# Altium schematic sheet pmic_tps65263_buck.SchDoc
size A
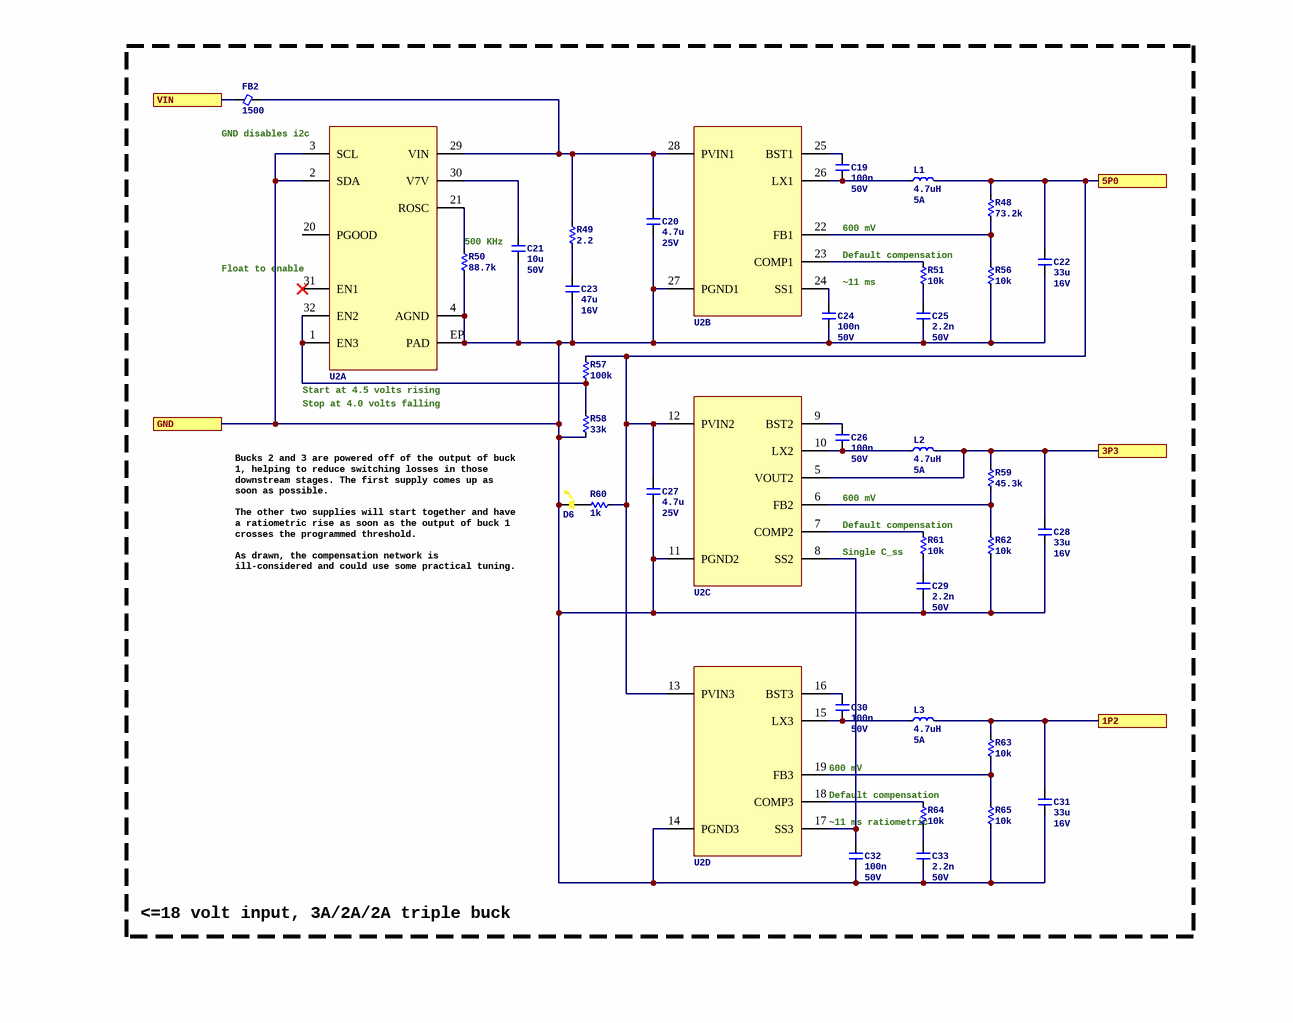
[diagram p0: pmic_tps65263_buck.SchDoc]

## Parts
C19  Capacitance: 100n  Voltage Rating: 50V  [C0402]  (hidden comment: CL05B104KB54PNC)
C20  Capacitance: 4.7u  Voltage Rating: 25V  [C0805]  (hidden comment: CL21B475KAFNNNE)
C21  Capacitance: 10u  Voltage Rating: 50V  [C1206]  (hidden comment: CL31B106KBHNNNE)
C22  Capacitance: 33u  Voltage Rating: 16V  [C1812]  (hidden comment: C4532X7R1C336MT000N)
C23  Capacitance: 47u  Voltage Rating: 16V  [C2220]  (hidden comment: CGA9N3X7R1C476MT0Y0N)
C24  Capacitance: 100n  Voltage Rating: 50V  [C0402]  (hidden comment: CL05B104KB54PNC)
C25  Capacitance: 2.2n  Voltage Rating: 50V  [C0402]  (hidden comment: GRM1555C1H222GA01D)
C26  Capacitance: 100n  Voltage Rating: 50V  [C0402]  (hidden comment: CL05B104KB54PNC)
C27  Capacitance: 4.7u  Voltage Rating: 25V  [C0805]  (hidden comment: CL21B475KAFNNNE)
C28  Capacitance: 33u  Voltage Rating: 16V  [C1812]  (hidden comment: C4532X7R1C336MT000N)
C29  Capacitance: 2.2n  Voltage Rating: 50V  [C0402]  (hidden comment: GRM1555C1H222GA01D)
C30  Capacitance: 100n  Voltage Rating: 50V  [C0402]  (hidden comment: CL05B104KB54PNC)
C31  Capacitance: 33u  Voltage Rating: 16V  [C1812]  (hidden comment: C4532X7R1C336MT000N)
C32  Capacitance: 100n  Voltage Rating: 50V  [C0402]  (hidden comment: CL05B104KB54PNC)
C33  Capacitance: 2.2n  Voltage Rating: 50V  [C0402]  (hidden comment: GRM1555C1H222GA01D)
D6  LTST-C190YKT  [LED_0603P_YELLOW]  (value not drawn)
FB2  Current Rating (mA): 1500  [FB0805]  (hidden comment: MPZ2012S102AT000)
L1  value 4.7uH  Current: 5A  [SMD-4.1x4.1x2.0]  (hidden comment: FTC404020S4R7MGCA)
L2  value 4.7uH  Current: 5A  [SMD-4.1x4.1x2.0]  (hidden comment: FTC404020S4R7MGCA)
L3  value 4.7uH  Current: 5A  [SMD-4.1x4.1x2.0]  (hidden comment: FTC404020S4R7MGCA)
R48  value 73.2k  [R0402]  (hidden comment: 0402WGF7322TCE)
R49  value 2.2  [R0805]  (hidden comment: HP05W3F220KT5E)
R50  value 88.7k  [R0402]  (hidden comment: 0402WGF8872TCE)
R51  value 10k  [R0402]  (hidden comment: 0402WGF1002TCE)
R56  value 10k  [R0402]  (hidden comment: 0402WGF1002TCE)
R57  value 100k  [R0402]  (hidden comment: 0402WGF1003TCE)
R58  value 33k  [R0402]  (hidden comment: 0402WGF3302TCE)
R59  value 45.3k  [R0402]  (hidden comment: FRC0402F4532TS)
R60  value 1k  [R0402]  (hidden comment: 0402WGF1001TCE)
R61  value 10k  [R0402]  (hidden comment: 0402WGF1002TCE)
R62  value 10k  [R0402]  (hidden comment: 0402WGF1002TCE)
R63  value 10k  [R0402]  (hidden comment: 0402WGF1002TCE)
R64  value 10k  [R0402]  (hidden comment: 0402WGF1002TCE)
R65  value 10k  [R0402]  (hidden comment: 0402WGF1002TCE)
U2  TPS65263QRHBRQ1  [TI_RHB]  (value not drawn)  (parts A,B,C,D of 4)

## Ports
1P2, 3P3, 5P0, GND, VIN

## Nets
1P2: C31.1 L3.2 R63.2 ; port 1P2
3P3: C28.1 L2.2 R59.2 U2.5(VOUT2) ; port 3P3
5P0: C22.1 C27.1 L1.2 R48.2 R57.2 R60.2 U2.12(PVIN2) U2.13(PVIN3) ; port 5P0
GND: C20.2 C21.2 C22.2 C23.2 C24.2 C25.2 C27.2 C28.2 C29.2 C31.2 C32.2 C33.2 D6.1 R50.1 R56.1 R58.1 R62.1 R65.1 U2.2(SDA) U2.3(SCL) U2.4(AGND) U2.11(PGND2) U2.14(PGND3) U2.27(PGND1) U2.EP(PAD) ; port GND
VIN: FB2.1 ; port VIN
NetC19_1: C19.1 U2.25(BST1)
NetC19_2: C19.2 L1.1 U2.26(LX1)
NetC20_1: C20.1 FB2.2 R49.2 U2.28(PVIN1) U2.29(VIN)
NetC21_1: C21.1 U2.30(V7V)
NetC23_1: C23.1 R49.1
NetC24_1: C24.1 U2.24(SS1)
NetC25_1: C25.1 R51.1
NetC26_1: C26.1 U2.9(BST2)
NetC26_2: C26.2 L2.1 U2.10(LX2)
NetC29_1: C29.1 R61.1
NetC30_1: C30.1 U2.16(BST3)
NetC30_2: C30.2 L3.1 U2.15(LX3)
NetC32_1: C32.1 U2.8(SS2) U2.17(SS3)
NetC33_1: C33.1 R64.1
NetD6_2: D6.2 R60.1
NetR48_1: R48.1 R56.2 U2.22(FB1)
NetR50_2: R50.2 U2.21(ROSC)
NetR51_2: R51.2 U2.23(COMP1)
NetR57_1: R57.1 R58.2 U2.1(EN3) U2.32(EN2)
NetR59_1: R59.1 R62.2 U2.6(FB2)
NetR61_2: R61.2 U2.7(COMP2)
NetR63_1: R63.1 R65.2 U2.19(FB3)
NetR64_2: R64.2 U2.18(COMP3)

Not connected (* = marked no-connect by the designer): U2 20(PGOOD) 31(EN1)*

## Notes on the sheet
- GND disables i2c
- 600 mV
- (near U2) Float to enable
- (near R50) 500 KHz
- (near R51) Default compensation
- ~11 ms
- (near U2) Start at 4.5 volts rising
- Stop at 4.0 volts falling
- Single C_ss
- (near R61) Default compensation
- Bucks 2 and 3 are powered off of the output of buck 1, helping to reduce switching losses in those downstream stages. The first supply comes up as soon as possible.
  The other two supplies will start together and have a ratiometric rise as soon as the output of buck 1 crosses the programmed threshold.
  As drawn, the compensation network is ill-considered and could use some practical tuning.
- (near U2) 600 mV
- (near R64) ~11 ms ratiometric
- (near R64) Default compensation
- <=18 volt input, 3A/2A/2A triple buck

## Library data of the parts
C19 C24 C26 C30 C32 = CL05B104KB54PNC: Manufacturer: Samsung Electro-Mechanics; Dielectric: X7R; ComponentLink1URL: https://wmsc.lcsc.com/wmsc/upload/file/pdf/v2/lcsc/2304140030_Samsung-Electro-Mechanics-CL05B104KB54PNC_C307331.pdf; ComponentLink1Description: Datasheet; Manufacturer Part Number: CL05B104KB54PNC; Package: 0402; Supplier 2: LCSC; Supplier Part Number 2: C307331
C20 C27 = CL21B475KAFNNNE: Manufacturer: Samsung Electro-Mechanics; Dielectric: X7R; ComponentLink1URL: https://wmsc.lcsc.com/wmsc/upload/file/pdf/v2/lcsc/2304140030_Samsung-Electro-Mechanics-CL21B475KAFNNNE_C98195.pdf; ComponentLink1Description: Datasheet; Manufacturer Part Number: CL21B475KAFNNNE; Package: 0805; Supplier 2: LCSC; Supplier Part Number 2: C98195
C21 = CL31B106KBHNNNE: Manufacturer: Samsung Electro-Mechanics; Dielectric: X7R; ComponentLink1URL: https://wmsc.lcsc.com/wmsc/upload/file/pdf/v2/lcsc/1810221111_Samsung-Electro-Mechanics-CL31B106KBHNNNE_C89632.pdf; ComponentLink1Description: Datasheet; Manufacturer Part Number: CL31B106KBHNNNE; Package: 1206; Supplier 2: LCSC; Supplier Part Number 2: C89632
C22 C28 C31 = C4532X7R1C336MT000N: Manufacturer: TDK; Dielectric: X7R; ComponentLink1URL: https://wmsc.lcsc.com/wmsc/upload/file/pdf/v2/lcsc/2304140030_TDK-C4532X7R1C336MT000N_C342604.pdf; ComponentLink1Description: Datasheet; Manufacturer Part Number: C4532X7R1C336MT000N; Package: 1812; Supplier 2: LCSC; Supplier Part Number 2: C342604
C23 = CGA9N3X7R1C476MT0Y0N: Manufacturer: TDK; Dielectric: X7R; ComponentLink1URL: https://wmsc.lcsc.com/wmsc/upload/file/pdf/v2/lcsc/2409301933_TDK-CGA9N3X7R1C476MT0Y0N_C342293.pdf; ComponentLink1Description: Datasheet; Manufacturer Part Number: CGA9N3X7R1C476MT0Y0N; Package: 2220; Supplier 2: LCSC; Supplier Part Number 2: C342293
C25 C29 C33 = GRM1555C1H222GA01D: Manufacturer: Murata Electronics; Dielectric: C0G; ComponentLink1URL: https://wmsc.lcsc.com/wmsc/upload/file/pdf/v2/lcsc/2206211730_Murata-Electronics-GRM1555C1H222GA01D_C2987940.pdf; ComponentLink1Description: Datasheet; Manufacturer Part Number: GRM1555C1H222GA01D; Package: 0402; Supplier 2: LCSC; Supplier Part Number 2: C2987940
D6 = LED_0603_YELLOW_LTST-C190YKT: LED YELLOW CLEAR 0603 SMD; Manufacturer: Lite-On Inc; Supplier 1: Digikey; ComponentLink1URL: https://mm.digikey.com/Volume0/opasdata/d220001/medias/docus/1176/LTST-C190YKT.pdf; ComponentLink1Description: Datasheet; Supplier Part Number 1: 160-1184-1-ND; Manufacturer Part Number: LTST-C190YKT; Supplier 2: LCSC; Supplier Part Number 2: C125097
FB2 = MPZ2012S102AT000: Manufacturer: TDK; Z @ 100 MHz: 1000; DCR (mOhms): 150; Manufacturer Part Number: MPZ2012S102AT000; Package: 0805; Supplier 2: LCSC; Supplier Part Number 2: C76817; ComponentLink1Description: Datasheet; ComponentLink1URL: https://wmsc.lcsc.com/wmsc/upload/file/pdf/v2/lcsc/2304140030_TDK-MPZ2012S102AT000_C76817.pdf
L1-L3 = IND_4.7UH_FTC404020S4R7MGCA: 5A 4.7uH 6.3A 58mΩ ±20% SMD,4.1x4.1mm Fixed Inductors RoHS; Manufacturer: cjiang; ComponentLink1URL: https://www.lcsc.com/datasheet/C39676072.pdf; ComponentLink1Description: Datasheet; Manufacturer Part Number: FTC404020S4R7MGCA; Supplier 2: LCSC; Supplier Part Number 2: C39676072
R48 = 0402WGF7322TCE: Manufacturer: UNI-ROYAL(Uniroyal Elec); Tolerance: 1%; Temperature Coefficient: Â±100ppm/â„ƒ; Power Rating (mW): 62.5; ComponentLink1Description: Datasheet; ComponentLink1URL: https://wmsc.lcsc.com/wmsc/upload/file/pdf/v2/lcsc/2206010030_UNI-ROYAL-Uniroyal-Elec-0402WGF7322TCE_C26986.pdf; Manufacturer Part Number: 0402WGF7322TCE; Package: 0402; Supplier 2: LCSC; Supplier Part Number 2: C26986
R49 = HP05W3F220KT5E: Manufacturer: UNI-ROYAL(Uniroyal Elec); Tolerance: 1%; Temperature Coefficient: Â±100ppm/â„ƒ; Power Rating (mW): 333.3; ComponentLink1Description: Datasheet; ComponentLink1URL: https://datasheet.lcsc.com/lcsc/2304140030_UNI-ROYAL-Uniroyal-Elec-HP05W3F220KT5E_C2759317.pdf; Manufacturer Part Number: HP05W3F220KT5E; Package: 0805; Supplier 2: LCSC; Supplier Part Number 2: C2759317
R50 = 0402WGF8872TCE: Manufacturer: UNI-ROYAL(Uniroyal Elec); Tolerance: 1%; Temperature Coefficient: Â±100ppm/â„ƒ; Power Rating (mW): 62.5; ComponentLink1Description: Datasheet; ComponentLink1URL: https://wmsc.lcsc.com/wmsc/upload/file/pdf/v2/lcsc/2206010045_UNI-ROYAL-Uniroyal-Elec-0402WGF8872TCE_C25922.pdf; Manufacturer Part Number: 0402WGF8872TCE; Package: 0402; Supplier 2: LCSC; Supplier Part Number 2: C25922
R51 R56 R61-R65 = 0402WGF1002TCE: Manufacturer: UNI-ROYAL(Uniroyal Elec); Tolerance: 1%; Temperature Coefficient: Â±100ppm/â„ƒ; Power Rating (mW): 62.5; ComponentLink1Description: Datasheet; ComponentLink1URL: https://wmsc.lcsc.com/wmsc/upload/file/pdf/v2/lcsc/2206010100_UNI-ROYAL-Uniroyal-Elec-0402WGF1002TCE_C25744.pdf; Manufacturer Part Number: 0402WGF1002TCE; Package: 0402; Supplier 2: LCSC; Supplier Part Number 2: C25744
R57 = 0402WGF1003TCE: Manufacturer: UNI-ROYAL(Uniroyal Elec); Tolerance: 1%; Temperature Coefficient: Â±100ppm/â„ƒ; Power Rating (mW): 62.5; ComponentLink1Description: Datasheet; ComponentLink1URL: https://wmsc.lcsc.com/wmsc/upload/file/pdf/v2/lcsc/2206010100_UNI-ROYAL-Uniroyal-Elec-0402WGF1003TCE_C25741.pdf; Manufacturer Part Number: 0402WGF1003TCE; Package: 0402; Supplier 2: LCSC; Supplier Part Number 2: C25741
R58 = 0402WGF3302TCE: Manufacturer: UNI-ROYAL(Uniroyal Elec); Tolerance: 1%; Temperature Coefficient: Â±100ppm/â„ƒ; Power Rating (mW): 62.5; ComponentLink1Description: Datasheet; ComponentLink1URL: https://wmsc.lcsc.com/wmsc/upload/file/pdf/v2/lcsc/2206010100_UNI-ROYAL-Uniroyal-Elec-0402WGF3302TCE_C25779.pdf; Manufacturer Part Number: 0402WGF3302TCE; Package: 0402; Supplier 2: LCSC; Supplier Part Number 2: C25779
R59 = FRC0402F4532TS: Manufacturer: FOJAN; Tolerance: 1%; Temperature Coefficient: Â±100ppm/â„ƒ; Power Rating (mW): 62.5; ComponentLink1Description: Datasheet; ComponentLink1URL: https://datasheet.lcsc.com/lcsc/2308241947_FOJAN-FRC0402F4532TS_C2933099.pdf; Manufacturer Part Number: FRC0402F4532TS; Package: 0402; Supplier 2: LCSC; Supplier Part Number 2: C2933099
R60 = 0402WGF1001TCE: Manufacturer: UNI-ROYAL(Uniroyal Elec); Tolerance: 1%; Temperature Coefficient: Â±100ppm/â„ƒ; Power Rating (mW): 62.5; ComponentLink1Description: Datasheet; ComponentLink1URL: https://wmsc.lcsc.com/wmsc/upload/file/pdf/v2/lcsc/2206010216_UNI-ROYAL-Uniroyal-Elec-0402WGF1001TCE_C11702.pdf; Manufacturer Part Number: 0402WGF1001TCE; Package: 0402; Supplier 2: LCSC; Supplier Part Number 2: C11702
U2 = BUCK_TPS65263QRHBRQ1: Switching Regulator, Current-mode, 3A, 2300kHz Switching Freq-Max, PQCC32; Manufacturer: Texas Instruments; ComponentLink4URL: https://www.ti.com/lit/ds/symlink/tps65263-q1.pdf; ComponentLink4Description: Datasheet; Supplier 1: Digikey; Supplier Part Number 1: 296-40886-1-ND; Supplier 2: LCSC; Supplier Part Number 2: C2073290; Manufacturer Part Number: TPS65263QRHBRQ1